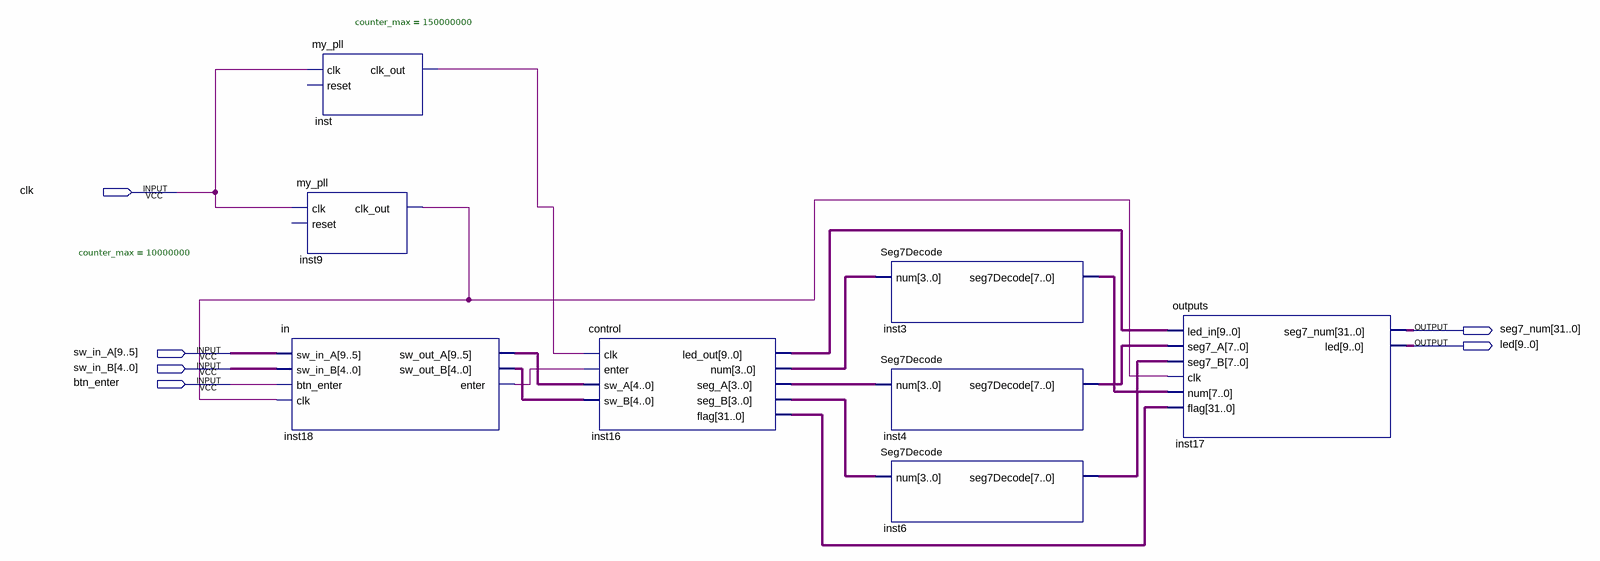
[diagram p0: schematic sheet]
// Quartus schematic Group09.bdf as structural Verilog: 8 symbols, 6 pins
module Group09 (
  input  clk,
  input  [9:5] sw_in_A,
  input  [4:0] sw_in_B,
  input  btn_enter,
  output [31:0] seg7_num,
  output [9:0] led
);

  wire inst9_clk_out, inst18_enter, inst_clk_out;
  wire [3:0] inst16_num, inst16_seg_a, inst16_seg_b;
  wire [4:0] inst18_sw_out_a, inst18_sw_out_b;
  wire [7:0] inst3_seg7decode, inst4_seg7decode, inst6_seg7decode;
  wire [9:0] inst16_led_out;
  wire [31:0] inst16_flag;

  in inst18 (
    .sw_in_A(sw_in_A), .sw_in_B(sw_in_B), .btn_enter(btn_enter), .clk(inst9_clk_out),
    .sw_out_A(inst18_sw_out_a), .sw_out_B(inst18_sw_out_b), .enter(inst18_enter));
  my_pll #(.counter_max(150000000)) inst (.clk(clk), .clk_out(inst_clk_out));  // open: reset
  my_pll #(.counter_max(10000000)) inst9 (.clk(clk), .clk_out(inst9_clk_out));  // open: reset
  control inst16 (
    .clk(inst_clk_out), .enter(inst18_enter), .sw_A(inst18_sw_out_a), .sw_B(inst18_sw_out_b),
    .led_out(inst16_led_out), .num(inst16_num), .seg_A(inst16_seg_a), .seg_B(inst16_seg_b), .flag(inst16_flag));
  Seg7Decode inst3 (.num(inst16_num), .seg7Decode(inst3_seg7decode));
  Seg7Decode inst4 (.num(inst16_seg_a), .seg7Decode(inst4_seg7decode));
  Seg7Decode inst6 (.num(inst16_seg_b), .seg7Decode(inst6_seg7decode));
  outputs inst17 (
    .led_in(inst16_led_out), .seg7_A(inst4_seg7decode), .seg7_B(inst6_seg7decode), .clk(inst9_clk_out),
    .num(inst3_seg7decode), .flag(inst16_flag), .seg7_num(seg7_num), .led(led));
endmodule
